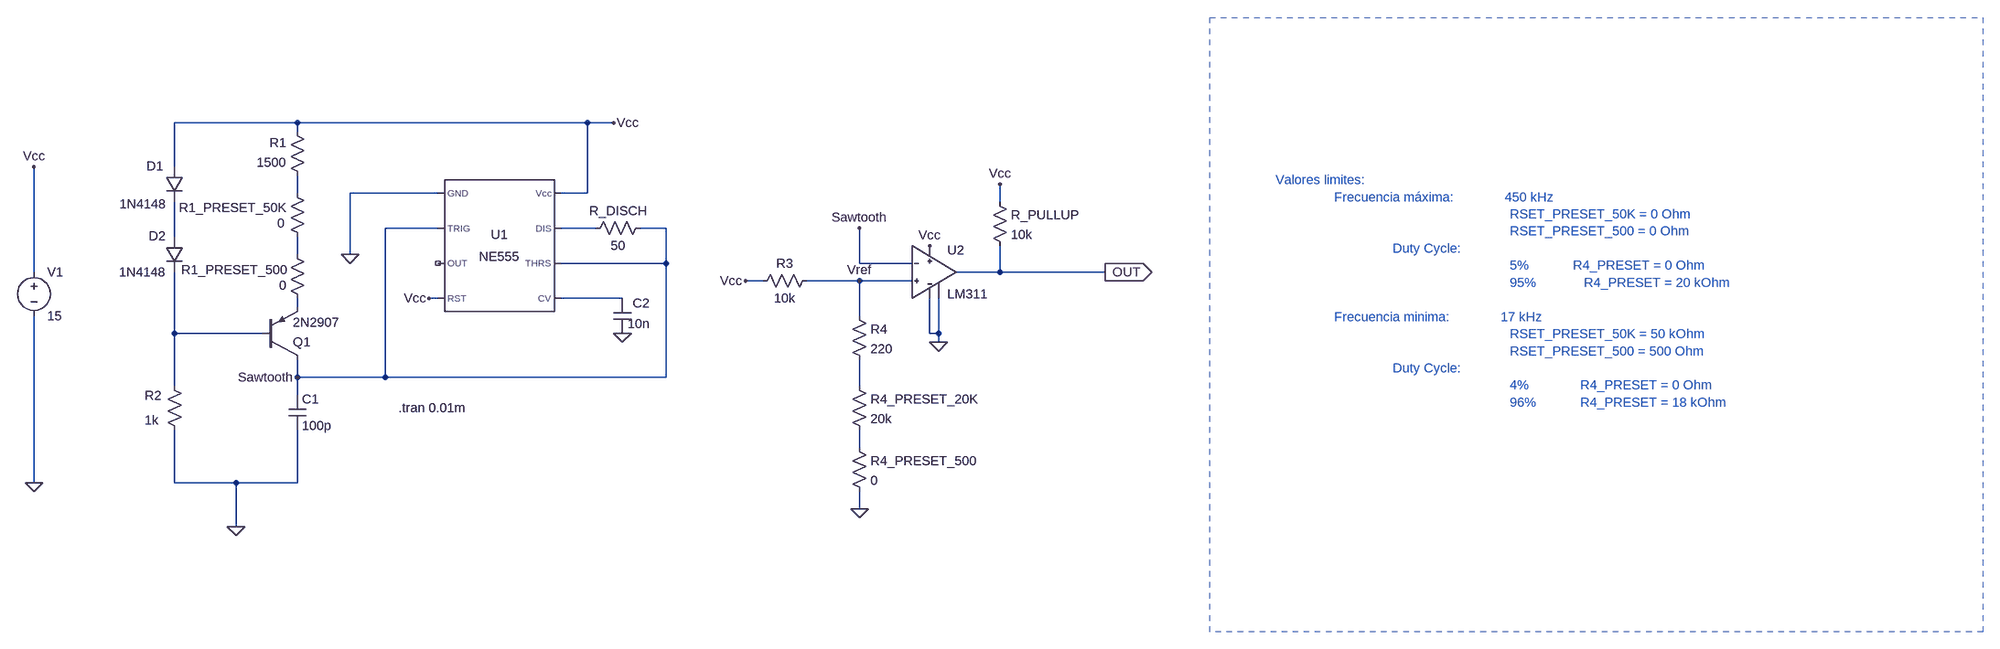
[diagram p0: schematic oscillator.asc]
oscillator.asc, the LTspice schematic file:
Version 4
SHEET 1 5988 1956
WIRE -480 -48 -704 -48
WIRE 48 -48 -480 -48
WIRE 96 -48 48 -48
WIRE -480 -32 -480 -48
WIRE -704 32 -704 -48
WIRE -480 80 -480 48
WIRE -224 80 -384 80
WIRE 48 80 48 -48
WIRE 48 80 0 80
WIRE 800 96 800 64
WIRE -224 144 -320 144
WIRE 64 144 0 144
WIRE 192 144 144 144
WIRE -704 160 -704 96
WIRE -480 192 -480 160
WIRE -384 192 -384 80
WIRE 192 208 192 144
WIRE 192 208 0 208
WIRE 544 208 544 144
WIRE 640 208 544 208
WIRE -1040 224 -1040 32
WIRE 800 224 800 176
WIRE 800 224 720 224
WIRE 992 224 800 224
WIRE 368 240 336 240
WIRE 544 240 448 240
WIRE 640 240 544 240
WIRE -224 272 -240 272
WIRE 112 272 0 272
WIRE -480 288 -480 272
WIRE 544 304 544 240
WIRE -704 336 -704 224
WIRE -544 336 -704 336
WIRE 672 336 672 272
WIRE 688 336 688 272
WIRE 688 336 672 336
WIRE 688 352 688 336
WIRE -480 416 -480 384
WIRE -320 416 -320 144
WIRE -320 416 -480 416
WIRE 192 416 192 208
WIRE 192 416 -320 416
WIRE -704 432 -704 336
WIRE 544 432 544 384
WIRE -480 448 -480 416
WIRE 544 544 544 512
WIRE -1040 608 -1040 304
WIRE -704 608 -704 512
WIRE -592 608 -704 608
WIRE -480 608 -480 512
WIRE -480 608 -592 608
WIRE 544 656 544 624
WIRE -592 688 -592 608
FLAG 112 336 0
FLAG -592 688 0
FLAG -480 416 Sawtooth
FLAG -1040 608 0
FLAG -1040 32 Vcc
FLAG 96 -48 Vcc
FLAG -384 192 0
FLAG -240 272 Vcc
FLAG 544 144 Sawtooth
FLAG 336 240 Vcc
FLAG 544 656 0
FLAG 672 176 Vcc
FLAG 992 224 OUT
IOPIN 992 224 Out
FLAG 800 64 Vcc
FLAG 688 352 0
FLAG 544 240 Vref
DATAFLAG 64 272 ""
SYMBOL res 160 128 R90
WINDOW 0 0 56 VBottom 2
WINDOW 3 32 56 VTop 2
SYMATTR InstName R_DISCH
SYMATTR Value 50
SYMBOL res -464 64 R180
WINDOW 0 36 76 Left 2
WINDOW 3 36 40 Left 2
SYMATTR InstName R1
SYMATTR Value 1500
SYMBOL res -464 176 R180
WINDOW 0 36 69 Left 2
WINDOW 3 39 41 Left 2
SYMATTR InstName R1_PRESET_50K
SYMATTR Value 0
SYMBOL cap -496 448 R0
SYMATTR InstName C1
SYMATTR Value 100p
SYMBOL pnp -544 384 M180
SYMATTR InstName Q1
SYMATTR Value 2N2907
SYMBOL res -720 416 R0
WINDOW 0 -38 33 Left 2
WINDOW 3 -38 78 Left 2
SYMATTR InstName R2
SYMATTR Value 1k
SYMBOL cap 96 272 R0
WINDOW 0 35 9 Left 2
WINDOW 3 26 46 Left 2
SYMATTR InstName C2
SYMATTR Value 10n
SYMBOL voltage -1040 208 R0
WINDOW 123 0 0 Left 0
WINDOW 39 0 0 Left 0
SYMATTR InstName V1
SYMATTR Value 15
SYMBOL FACUsym\\LM311 672 224 R0
SYMATTR InstName U2
SYMBOL res 464 224 R90
WINDOW 0 0 56 VBottom 2
WINDOW 3 32 56 VTop 2
SYMATTR InstName R3
SYMATTR Value 10k
SYMBOL res 528 288 R0
SYMATTR InstName R4
SYMATTR Value 220
SYMBOL res 528 416 R0
SYMATTR InstName R4_PRESET_20K
SYMATTR Value 20k
SYMBOL res 784 80 R0
SYMATTR InstName R_PULLUP
SYMATTR Value 10k
SYMBOL diode -720 32 R0
WINDOW 0 -35 -1 Left 2
WINDOW 3 -84 68 Left 2
SYMATTR InstName D1
SYMATTR Value 1N4148
SYMBOL diode -720 160 R0
WINDOW 0 -31 -2 Left 2
WINDOW 3 -85 64 Left 2
SYMATTR InstName D2
SYMATTR Value 1N4148
SYMBOL res -464 288 R180
WINDOW 0 34 68 Left 2
WINDOW 3 36 40 Left 2
SYMATTR InstName R1_PRESET_500
SYMATTR Value 0
SYMBOL Misc\\NE555 -112 176 R0
SYMATTR InstName U1
SYMBOL res 528 528 R0
SYMATTR InstName R4_PRESET_500
SYMATTR Value 0
TEXT -296 472 Left 2 !.tran 0.01m
TEXT 1656 56 Left 2 ;Valores limites:\n                Frecuencia máxima:              450 kHz\n                                                                RSET_PRESET_50K = 0 Ohm\n                                                                RSET_PRESET_500 = 0 Ohm\n                                Duty Cycle:     \n                                                                5%            R4_PRESET = 0 Ohm\n                                                                95%             R4_PRESET = 20 kOhm\n                    \n                Frecuencia minima:              17 kHz\n                                                                RSET_PRESET_50K = 50 kOhm\n                                                                RSET_PRESET_500 = 500 Ohm\n                                Duty Cycle:     \n                                                                4%              R4_PRESET = 0 Ohm\n                                                                96%            R4_PRESET = 18 kOhm
RECTANGLE Normal 2944 880 1536 -240 2

The netlist it stands for:
* oscillator.asc
R_DISCH Sawtooth N002 50
R1 N001 Vcc 1500
R1_PRESET_50K N004 N001 0
C1 Sawtooth 0 100p
Q1 Sawtooth N007 N006 0 2N2907
R2 N007 0 1k
C2 N005 0 10n
V1 Vcc 0 15
XU2 Vref Sawtooth Vcc 0 OUT 0 LM311  ; pins In+ In- VCC VEE OC_OUT GND_OUT
R3 Vref Vcc 10k
R4 Vref N008 220
R4_PRESET_20K N008 N009 20k
R_PULLUP Vcc OUT 10k
D1 Vcc N003 1N4148
D2 N003 N007 1N4148
R1_PRESET_500 N006 N004 0
XU1 0 Sawtooth NC_01 Vcc N005 Sawtooth N002 Vcc NE555  ; pins GND TRIG OUT RST CV THRS DIS Vcc
R4_PRESET_500 N009 0 0
.model D D
.lib standard.dio
.model NPN NPN
.model PNP PNP
.lib standard.bjt
.tran 0.01m
* Valores limites:
*                 Frecuencia máxima:              450 kHz
*                                                                 RSET_PRESET_50K = 0 Ohm
*                                                                 RSET_PRESET_500 = 0 Ohm
*                                 Duty Cycle:
*                                                                 5%            R4_PRESET = 0 Ohm
*                                                                 95%             R4_PRESET = 20 kOhm
*                 Frecuencia minima:              17 kHz
*                                                                 RSET_PRESET_50K = 50 kOhm
*                                                                 RSET_PRESET_500 = 500 Ohm
*                                 Duty Cycle:
*                                                                 4%              R4_PRESET = 0 Ohm
*                                                                 96%            R4_PRESET = 18 kOhm
.lib LM311.sub
.lib NE555.sub
.backanno
.end